# Altium schematic sheet GC2USB.SchDoc: GC2USB Adapter
size 381 x 241 mm; PageSetup: Record=PageOptions|CenterHorizontal=True|CenterVertical=True|PrintScale=0.77|XCorrection=1.00|YCorrection=1.00|PrintKind=0|BorderSize=5000000|LeftOffset=0|BottomOffset=0|Orientation=2|PaperLength=1000|PaperWidth=1000|Scale=100|PaperSource=7|PrintQuality=-4|MediaType=1|DitherType=10|PaperKind=A4|PrintScaleMode=1; OKEY_VENDOR: 0016; OKEY_PRODUCT: 0001
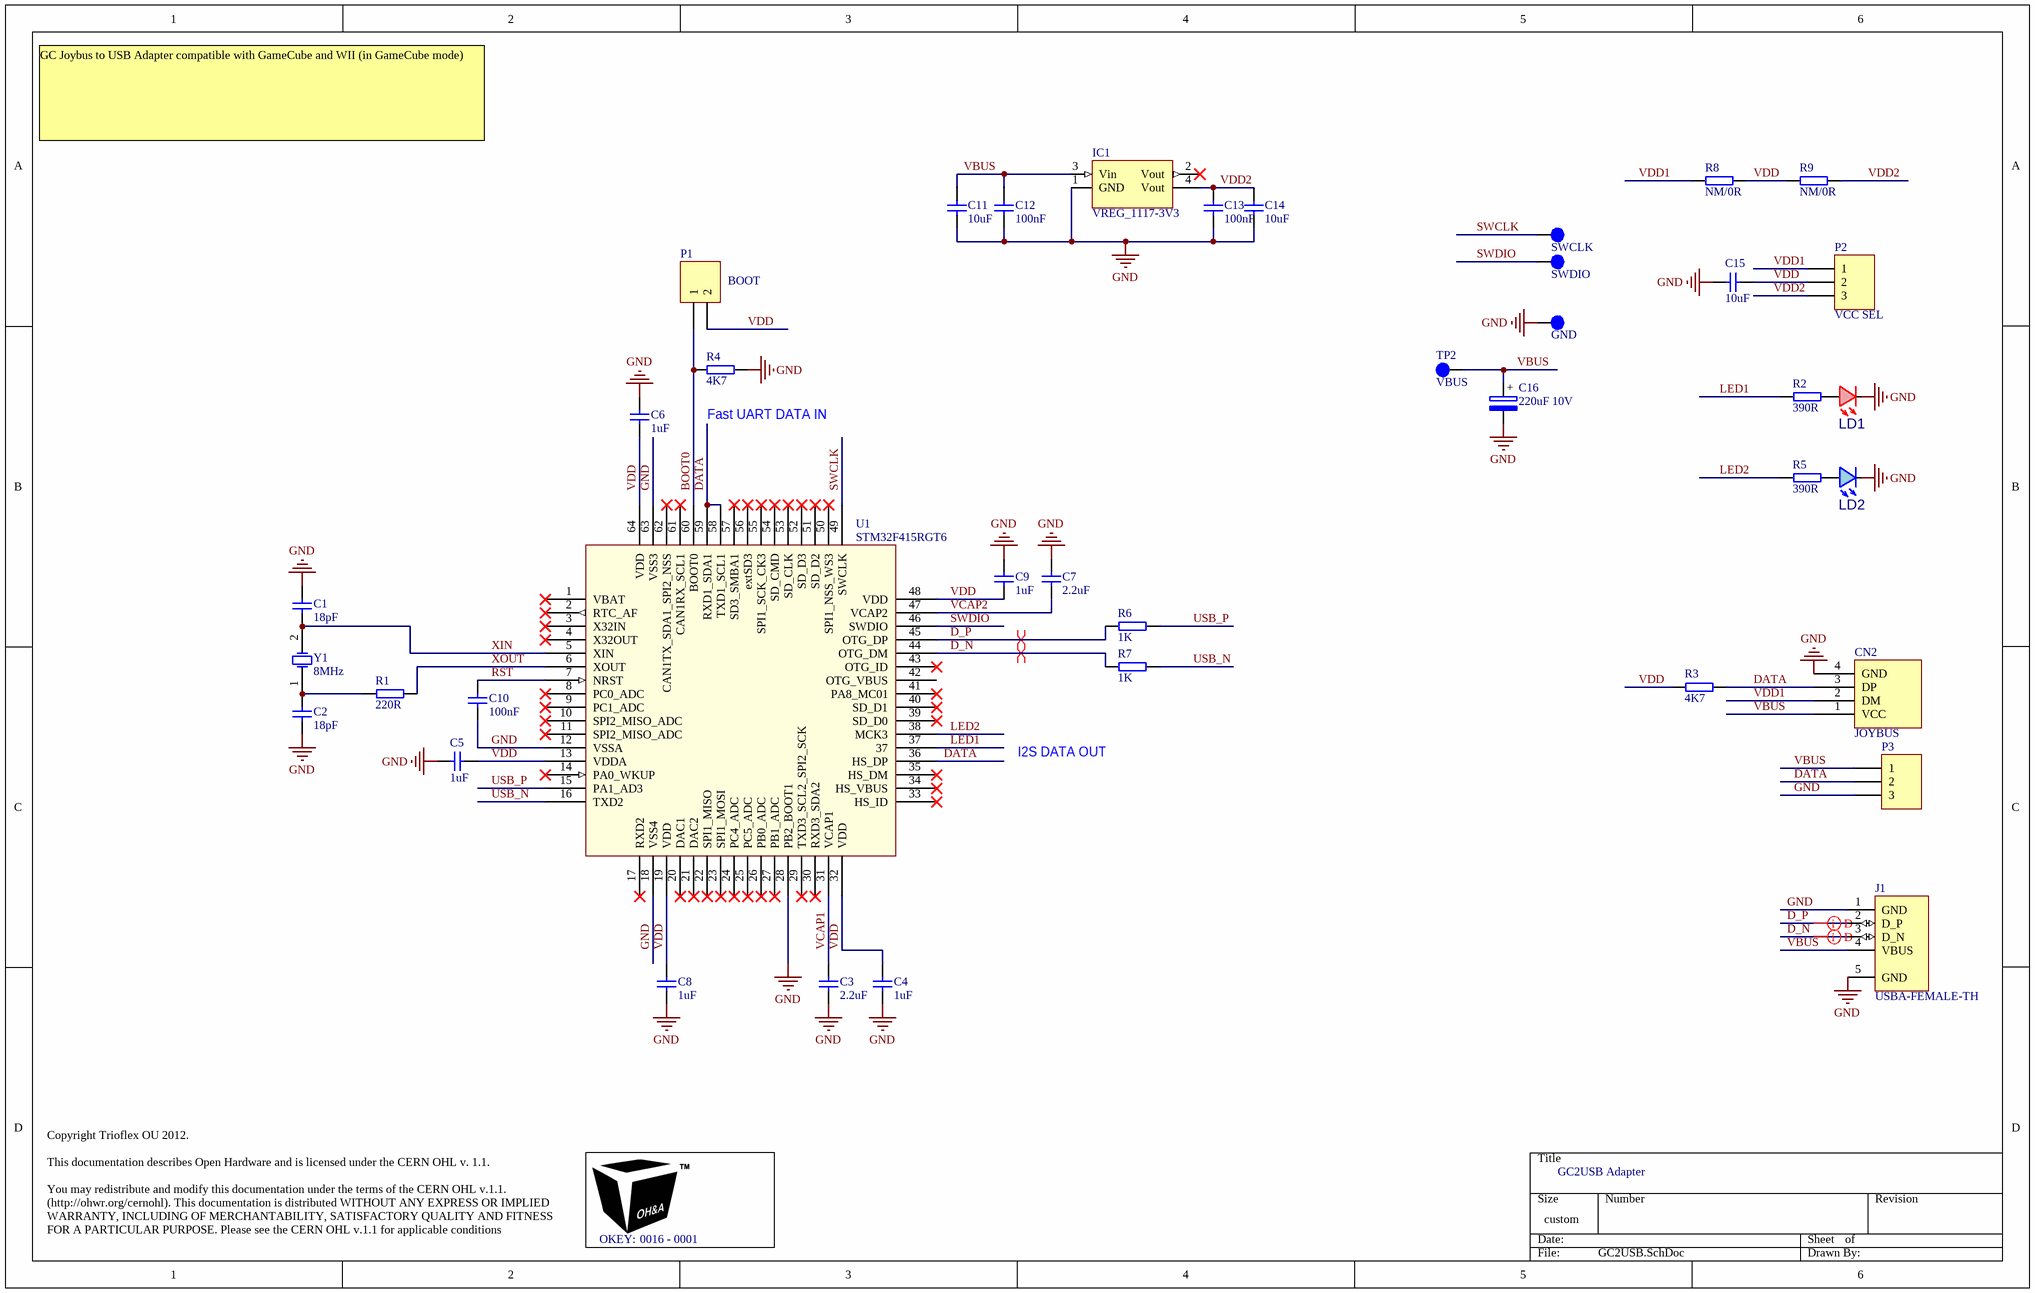
[diagram p0: GC2USB.SchDoc]

## Parts
C1  value 18pF  [C0603]  (hidden comment: CAP-NP)
C2  value 18pF  [C0603]  (hidden comment: CAP-NP)
C3  value 2.2uF  [C0603]  (hidden comment: CAP-NP)
C4  value 1uF  [C0603]  (hidden comment: CAP-NP)
C5  value 1uF  [C0603]  (hidden comment: CAP-NP)
C6  value 1uF  [C0603]  (hidden comment: CAP-NP)
C7  value 2.2uF  [C0603]  (hidden comment: CAP-NP)
C8  value 1uF  [C0603]  (hidden comment: CAP-NP)
C9  value 1uF  [C0603]  (hidden comment: CAP-NP)
C10  value 100nF  [C0603]  (hidden comment: CAP-NP)
C11  value 10uF  [C0805]  (hidden comment: CAP-NP)
C12  value 100nF  [C0603]  (hidden comment: CAP-NP)
C13  value 100nF  [C0603]  (hidden comment: CAP-NP)
C14  value 10uF  [C0805]  (hidden comment: CAP-NP)
C15  value 10uF  [C0805]  (hidden comment: CAP-NP)
C16  220uF 10V  [D-7MM]
CN2  JOYBUS  [4pin-header-2mm]  (no BOM)
GND  TP  [TP-SMD-2mm]  (value not drawn)  (no BOM)
IC1  VREG_1117-3V3  [SOT223]
J1  USBA-FEMALE-TH  [USBA-FEMALE-THR-HOLE]
LD1  RED-LED  [0603]  (value not drawn)
LD2  BLUE-LED  [0603]  (value not drawn)
P1  BOOT  [HDR1X2]  (no BOM)
P2  VCC SEL  [HDR1X3]
P3  *  [HDR1X3]  (value not drawn)  (no BOM)
R1  value 220R  [R0603]  (hidden comment: RES)
R2  value 390R  [R0603]  (hidden comment: RES)
R3  value 4K7  [R0603]  (hidden comment: RES)
R4  value 4K7  [R0603]  (hidden comment: RES)
R5  value 390R  [R0603]  (hidden comment: RES)
R6  1K  [R0603]
R7  1K  [R0603]
R8  NM/0R  [R0603]  (no BOM)
R9  NM/0R  [R0603]  (no BOM)
SWCLK  TP  [TP-SMD-2mm]  (value not drawn)  (no BOM)
SWDIO  TP  [TP-SMD-2mm]  (value not drawn)  (no BOM)
TP2  VBUS  [TP-SMD-2mm]  (no BOM)
U1  STM32F415RGT6  [STM-TQFP64]
Y1  value 8MHz  [HC49-THSMD]  (hidden comment: XTAL-2P)

## Nets
GND: C1.1 C2.2 C3.2 C4.1 C5.2 C6.1 C7.2 C8.2 C9.1 C10.2 C11.2 C12.2 C13.2 C14.2 C15.1 C16.2 CN2.4(GND) GND.1 IC1.1(GND) J1.1(GND) J1.5(GND) LD1.C(C-) LD2.C(C-) P3.3 R4.2 U1.12(VSSA) U1.18(VSS4) U1.28(PB2_BOOT1) U1.63(VSS3)
BOOT0: P1.1 R4.1 U1.60(BOOT0)
D_N: J1.3(D_N) R7.1 U1.44(OTG_DM)
D_P: J1.2(D_P) R6.1 U1.45(OTG_DP)
DATA: CN2.3(DP) P3.2 R3.1 U1.36(HS_DP) U1.58(TXD1_SCL1) U1.59(RXD1_SDA1)
LED1: R2.2 U1.37
LED2: R5.2 U1.38(MCK3)
RST: C10.1 U1.7(NRST)
SWCLK: SWCLK.1 U1.49(SWCLK)
SWDIO: SWDIO.1 U1.46(SWDIO)
USB_N: R7.2 U1.16(TXD2)
USB_P: R6.2 U1.15(PA1_AD3)
VBUS: C11.1 C12.1 C16.1 CN2.1(VCC) IC1.3(Vin) J1.4(VBUS) P3.1 TP2.1
VCAP1: C3.1 U1.31(VCAP1)
VCAP2: C7.1 U1.47(VCAP2)
VDD: C4.2 C5.1 C6.2 C8.1 C9.2 C15.2 P1.2 P2.2 R3.2 R8.2 R9.1 U1.13(VDDA) U1.19(VDD) U1.32(VDD) U1.48(VDD) U1.64(VDD)
VDD1: CN2.2(DM) P2.1 R8.1
VDD2: C13.1 C14.1 IC1.4(Vout) P2.3 R9.2
XIN: C1.2 U1.5(XIN) Y1.2
XOUT: R1.2 U1.6(XOUT)
NetC2_1: C2.1 R1.1 Y1.1(OSC1)
NetLD1_A: LD1.A(A+) R2.1
NetLD2_A: LD2.A(A+) R5.1

Not connected (* = marked no-connect by the designer): IC1 2(Vout)*; U1 1(VBAT)* 2(RTC_AF)* 3(X32IN)* 4(X32OUT)* 8(PC0_ADC)* 9(PC1_ADC)* 10(SPI2_MISO_ADC)* 11(SPI2_MISO_ADC)* 14(PA0_WKUP)* 17(RXD2)* 20(DAC1)* 21(DAC2)* 22(SPI1_MISO)* 23(SPI1_MOSI)* 24(PC4_ADC)* 25(PC5_ADC)* 26(PB0_ADC)* 27(PB1_ADC)* 29(TXD3_SCL2_SPI2_SCK)* 30(RXD3_SDA2)* 33(HS_ID)* 34(HS_VBUS)* 35(HS_DM)* 39(SD_D0)* 40(SD_D1)* 41(PA8_MC01)* 42(OTG_VBUS) 43(OTG_ID)* 50(SPI1_NSS_WS3)* 51(SD_D2)* 52(SD_D3)* 53(SD_CLK)* 54(SD_CMD)* 55(SPI1_SCK_CK3)* 56(extSD3)* 57(SD3_SMBA1)* 61(CAN1RX_SCL1)* 62(CAN1TX_SDA1_SPI2_NSS)*

## Layout directives
differential pair: D_N, D_P

## Notes on the sheet
- GC Joybus to USB Adapter compatible with GameCube and WII (in GameCube mode)
- (near R4) Fast UART DATA IN
- I2S DATA OUT
- Copyright Trioflex OU 2012.
  This documentation describes Open Hardware and is licensed under the CERN OHL v. 1.1.
  You may redistribute and modify this documentation under the terms of the CERN OHL v.1.1. (http://ohwr.org/cernohl). This documentation is distributed WITHOUT ANY EXPRESS OR IMPLIED WARRANTY, INCLUDING OF MERCHANTABILITY, SATISFACTORY QUALITY AND FITNESS FOR A PARTICULAR PURPOSE. Please see the CERN OHL v.1.1 for applicable conditions
- OKEY:
- -
- (in symbol CAP-P-SMD) +

## Library data of the parts
C1-C10 C12 C13 = C0603: capacitor; ID: 2; Component: C0603
C11 C14 C15 = C0805: capacitor; ID: 3; Component: C0805
C16 = CAP-P-SMD: polarized capacitor; ID: 5; Value: CAP-P-SMD; Component: CAP-P-SMD
CN2 = USB_PCBCON: L_DB: CN01; ValueSCH: Vsch
GND SWCLK SWDIO TP2 = TP-SMD-2mm: Testpoint; ID: 4; Value: TP-SMD-2mm; Component: TP-SMD-2mm
IC1 = VREG_1117: ID: 4; Value: VREG_1117-3V3; Component: VREG_1117
J1 = USBA-FEMALE-THR-HOLE: ID: 57; Value: USBA-FEMALE-THR-HOLE; Component: USBA-FEMALE-THR-HOLE
LD1 = RED-LED-SMD: ID: 3; Value: RED-LED-SMD; Component: RED-LED-SMD
LD2 = BLUE-LED-SMD: ID: 1; Value: BLUE-LED-SMD; Component: BLUE-LED-SMD
P1 = Header 2: Header, 2-Pin; LatestRevisionDate: 17-Jul-2002; LatestRevisionNote: Re-released for DXP Platform.; Publisher: Altium Limited
P2 P3 = Header 3: Header, 3-Pin; LatestRevisionDate: 17-Jul-2002; LatestRevisionNote: Re-released for DXP Platform.; Publisher: Altium Limited
R1-R9 = R0603: Resistor; ID: 2; Component: R0603
  R6 R7: Value: 1K
  R8 R9: Value: NM/0R
U1 = STM32F415RGT6: ID: 4; Value: STM32F415RGT6; Component: STM32F415RGT6
Y1 = XTAL-2P: Crystal Oscillator; ID: 1; Component: XTAL-2P